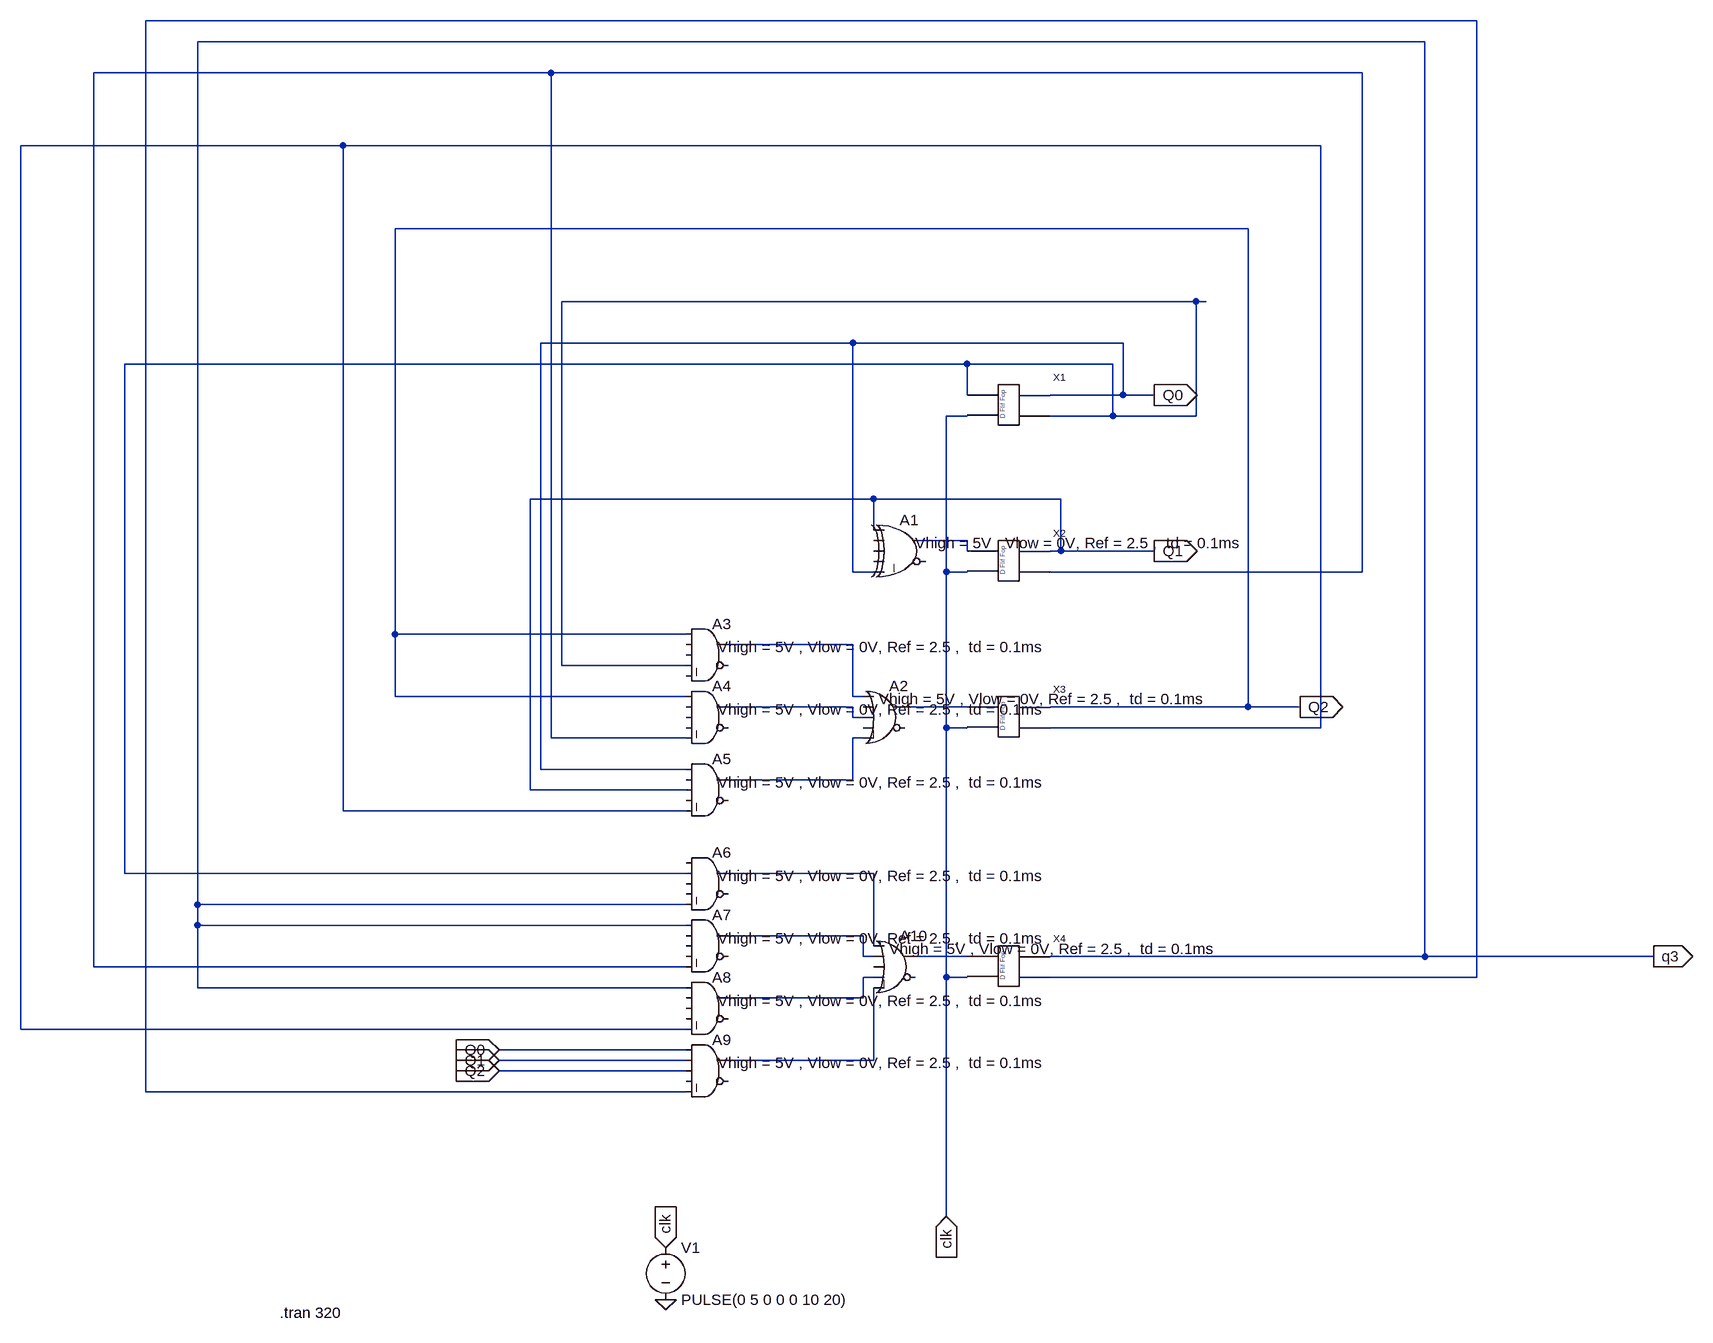
[diagram p0: schematic counter.asc]
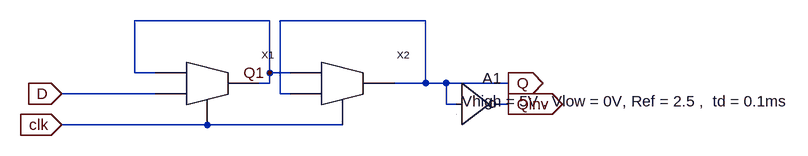
[diagram p1: sub-circuit d_flip_flop.asc]
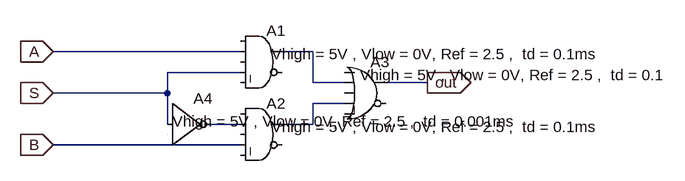
[diagram p2: sub-circuit 2_1_mux.asc]
counter.asc, the LTspice schematic file:
Version 4
SHEET 1 1448 1092
WIRE 1088 -912 -960 -912
WIRE 1008 -880 -880 -880
WIRE -336 -832 -1040 -832
WIRE 912 -832 -336 -832
WIRE -656 -720 -1152 -720
WIRE 848 -720 -656 -720
WIRE 736 -592 -576 -592
WIRE 656 -480 -320 -480
WIRE 672 -480 656 -480
WIRE 128 -416 -352 -416
WIRE 544 -416 128 -416
WIRE 304 -384 -992 -384
WIRE 528 -384 304 -384
WIRE 304 -336 304 -384
WIRE 544 -336 544 -416
WIRE 544 -336 432 -336
WIRE 592 -336 544 -336
WIRE 304 -304 272 -304
WIRE 528 -304 528 -384
WIRE 528 -304 432 -304
WIRE 656 -304 656 -480
WIRE 656 -304 528 -304
WIRE 160 -176 -368 -176
WIRE 448 -176 160 -176
WIRE 160 -128 160 -176
WIRE 304 -112 224 -112
WIRE 304 -96 304 -112
WIRE 448 -96 448 -176
WIRE 448 -96 432 -96
WIRE 592 -96 448 -96
WIRE 128 -64 128 -416
WIRE 160 -64 128 -64
WIRE 272 -64 272 -304
WIRE 304 -64 272 -64
WIRE 912 -64 912 -832
WIRE 912 -64 432 -64
WIRE -576 32 -576 -592
WIRE -128 32 -576 32
WIRE 128 48 -64 48
WIRE -320 80 -320 -480
WIRE -128 80 -320 80
WIRE -576 128 -576 32
WIRE -128 128 -576 128
WIRE 128 128 128 48
WIRE 144 128 128 128
WIRE 128 144 -64 144
WIRE 304 144 208 144
WIRE 736 144 736 -592
WIRE 736 144 432 144
WIRE 816 144 736 144
WIRE 128 160 128 144
WIRE 144 160 128 160
WIRE 272 176 272 -64
WIRE 304 176 272 176
WIRE 848 176 848 -720
WIRE 848 176 432 176
WIRE -336 192 -336 -832
WIRE -128 192 -336 192
WIRE 144 192 128 192
WIRE -352 240 -352 -416
WIRE -128 240 -352 240
WIRE 128 256 128 192
WIRE 128 256 -64 256
WIRE -368 272 -368 -176
WIRE -128 272 -368 272
WIRE -656 304 -656 -720
WIRE -128 304 -656 304
WIRE -992 400 -992 -384
WIRE -128 400 -992 400
WIRE 160 400 -64 400
WIRE -880 448 -880 -880
WIRE -128 448 -880 448
WIRE -880 480 -880 448
WIRE -128 480 -880 480
WIRE 144 496 -64 496
WIRE 160 512 160 400
WIRE 144 528 144 496
WIRE 160 528 144 528
WIRE 304 528 224 528
WIRE 1008 528 1008 -880
WIRE 1008 528 432 528
WIRE 1360 528 1008 528
WIRE -1040 544 -1040 -832
WIRE -128 544 -1040 544
WIRE 160 560 144 560
WIRE 272 560 272 176
WIRE 304 560 272 560
WIRE 1088 560 1088 -912
WIRE 1088 560 432 560
WIRE -880 576 -880 480
WIRE -128 576 -880 576
WIRE 144 592 144 560
WIRE 144 592 -64 592
WIRE -1152 640 -1152 -720
WIRE -128 640 -1152 640
WIRE -128 672 -416 672
WIRE -128 688 -416 688
WIRE 160 688 160 576
WIRE 160 688 -64 688
WIRE -128 704 -416 704
WIRE -960 736 -960 -912
WIRE -128 736 -960 736
WIRE 272 928 272 560
FLAG -160 976 clk
IOPIN -160 976 In
FLAG 272 928 clk
IOPIN 272 928 In
FLAG 592 -336 Q0
IOPIN 592 -336 Out
FLAG 592 -96 Q1
IOPIN 592 -96 Out
FLAG 816 144 Q2
IOPIN 816 144 Out
FLAG 1360 528 q3
IOPIN 1360 528 Out
FLAG -160 1056 0
FLAG -416 672 Q0
IOPIN -416 672 In
FLAG -416 688 Q1
IOPIN -416 688 In
FLAG -416 704 Q2
IOPIN -416 704 In
SYMBOL D_flip_flop 368 -320 R0
SYMATTR InstName X1
SYMBOL D_flip_flop 368 -80 R0
SYMATTR InstName X2
SYMBOL D_flip_flop 368 160 R0
SYMATTR InstName X3
SYMBOL D_flip_flop 368 544 R0
SYMATTR InstName X4
SYMBOL Digital\\xor 208 -160 R0
WINDOW 3 16 52 Left 2
SYMATTR InstName A1
SYMATTR Value Vhigh = 5V , Vlow = 0V, Ref = 2.5 ,  td = 0.1ms
SYMBOL Digital\\or 176 96 R0
WINDOW 3 -8 36 Left 2
SYMATTR InstName A2
SYMATTR Value Vhigh = 5V , Vlow = 0V, Ref = 2.5 ,  td = 0.1ms
SYMBOL Digital\\and -96 0 R0
WINDOW 3 16 52 Left 2
SYMATTR InstName A3
SYMATTR Value Vhigh = 5V , Vlow = 0V, Ref = 2.5 ,  td = 0.1ms
SYMBOL Digital\\and -96 96 R0
WINDOW 3 16 52 Left 2
SYMATTR InstName A4
SYMATTR Value Vhigh = 5V , Vlow = 0V, Ref = 2.5 ,  td = 0.1ms
SYMBOL Digital\\and -96 208 R0
WINDOW 3 16 52 Left 2
SYMATTR InstName A5
SYMATTR Value Vhigh = 5V , Vlow = 0V, Ref = 2.5 ,  td = 0.1ms
SYMBOL Digital\\and -96 352 R0
WINDOW 3 16 52 Left 2
SYMATTR InstName A6
SYMATTR Value Vhigh = 5V , Vlow = 0V, Ref = 2.5 ,  td = 0.1ms
SYMBOL Digital\\and -96 448 R0
WINDOW 3 16 52 Left 2
SYMATTR InstName A7
SYMATTR Value Vhigh = 5V , Vlow = 0V, Ref = 2.5 ,  td = 0.1ms
SYMBOL Digital\\and -96 544 R0
WINDOW 3 16 52 Left 2
SYMATTR InstName A8
SYMATTR Value Vhigh = 5V , Vlow = 0V, Ref = 2.5 ,  td = 0.1ms
SYMBOL Digital\\and -96 640 R0
WINDOW 3 16 52 Left 2
SYMATTR InstName A9
SYMATTR Value Vhigh = 5V , Vlow = 0V, Ref = 2.5 ,  td = 0.1ms
SYMBOL Digital\\or 192 480 R0
WINDOW 3 -8 36 Left 2
SYMATTR InstName A10
SYMATTR Value Vhigh = 5V , Vlow = 0V, Ref = 2.5 ,  td = 0.1ms
SYMBOL voltage -160 960 R0
WINDOW 123 0 0 Left 0
WINDOW 39 0 0 Left 0
SYMATTR InstName V1
SYMATTR Value PULSE(0 5 0 0 0 10 20)
TEXT -754 1076 Left 2 !.tran 320

d_flip_flop.asc, the sub-circuit schematic file:
Version 4
SHEET 1 1068 680
WIRE 224 0 16 0
WIRE 464 0 240 0
WIRE 16 80 16 0
WIRE 48 80 16 80
WIRE 224 80 224 0
WIRE 256 80 224 80
WIRE 224 96 224 80
WIRE 224 96 208 96
WIRE 464 96 464 0
WIRE 464 96 416 96
WIRE 496 96 464 96
WIRE 592 96 496 96
WIRE 48 112 -96 112
WIRE 240 112 240 0
WIRE 256 112 240 112
WIRE 496 128 496 96
WIRE 512 128 496 128
WIRE 592 128 576 128
WIRE 128 160 -96 160
WIRE 336 160 128 160
FLAG -96 112 D
IOPIN -96 112 In
FLAG -96 160 clk
IOPIN -96 160 In
FLAG 592 96 Q
IOPIN 592 96 Out
FLAG 592 128 Qinv
IOPIN 592 128 Out
FLAG 224 80 Q1
SYMBOL 2_1_mux 112 96 R0
SYMATTR InstName X1
SYMBOL 2_1_mux 320 96 R0
SYMATTR InstName X2
SYMBOL Digital\\inv 512 64 R0
WINDOW 3 8 60 Left 2
SYMATTR Value Vhigh = 5V , Vlow = 0V, Ref = 2.5 ,  td = 0.1ms
SYMATTR InstName A1

2_1_mux.asc, the sub-circuit schematic file:
Version 4
SHEET 1 880 840
WIRE 160 80 -128 80
WIRE 272 80 224 80
WIRE 160 112 48 112
WIRE 272 128 272 80
WIRE 320 128 272 128
WIRE 448 128 384 128
WIRE 48 144 48 112
WIRE 48 144 -128 144
WIRE 320 160 272 160
WIRE 48 192 48 144
WIRE 160 192 112 192
WIRE 272 192 272 160
WIRE 272 192 224 192
WIRE 160 224 -128 224
FLAG 448 128 out
IOPIN 448 128 Out
FLAG -128 80 A
IOPIN -128 80 In
FLAG -128 144 S
IOPIN -128 144 In
FLAG -128 224 B
IOPIN -128 224 In
SYMBOL Digital\\and 192 32 R0
WINDOW 3 16 52 Left 2
SYMATTR InstName A1
SYMATTR Value Vhigh = 5V , Vlow = 0V, Ref = 2.5 ,  td = 0.1ms
SYMBOL Digital\\and 192 144 R0
WINDOW 3 16 52 Left 2
SYMATTR InstName A2
SYMATTR Value Vhigh = 5V , Vlow = 0V, Ref = 2.5 ,  td = 0.1ms
SYMBOL Digital\\or 352 80 R0
WINDOW 3 -8 36 Left 2
SYMATTR InstName A3
SYMATTR Value Vhigh = 5V , Vlow = 0V, Ref = 2.5 ,  td = 0.1
SYMBOL Digital\\inv 48 128 R0
WINDOW 3 8 60 Left 2
SYMATTR InstName A4
SYMATTR Value Vhigh = 5V , Vlow = 0V, Ref = 2.5 ,  td = 0.001ms

The netlist it stands for:
* counter.asc
XX1 N004 clk Q0 N004 d_flip_flop
XX2 N005 clk Q1 N002 d_flip_flop
XX3 N008 clk Q2 N003 d_flip_flop
XX4 N012 clk q3 N001 d_flip_flop
A1 Q1 0 0 0 Q0 0 N005 0 XOR Vhigh = 5V , Vlow = 0V, Ref = 2.5 ,  td = 0.1ms
A2 N006 0 N007 0 N009 0 N008 0 OR Vhigh = 5V , Vlow = 0V, Ref = 2.5 ,  td = 0.1ms
A3 Q2 0 0 N004 0 0 N006 0 AND Vhigh = 5V , Vlow = 0V, Ref = 2.5 ,  td = 0.1ms
A4 Q2 0 0 0 N002 0 N007 0 AND Vhigh = 5V , Vlow = 0V, Ref = 2.5 ,  td = 0.1ms
A5 Q0 0 Q1 0 N003 0 N009 0 AND Vhigh = 5V , Vlow = 0V, Ref = 2.5 ,  td = 0.1ms
A6 0 N004 0 0 q3 0 N010 0 AND Vhigh = 5V , Vlow = 0V, Ref = 2.5 ,  td = 0.1ms
A7 q3 0 0 0 N002 0 N011 0 AND Vhigh = 5V , Vlow = 0V, Ref = 2.5 ,  td = 0.1ms
A8 q3 0 0 0 N003 0 N013 0 AND Vhigh = 5V , Vlow = 0V, Ref = 2.5 ,  td = 0.1ms
A9 Q0 Q1 Q2 0 N001 0 N014 0 AND Vhigh = 5V , Vlow = 0V, Ref = 2.5 ,  td = 0.1ms
A10 N010 N011 0 N013 N014 0 N012 0 OR Vhigh = 5V , Vlow = 0V, Ref = 2.5 ,  td = 0.1ms
V1 clk 0 PULSE(0 5 0 0 0 10 20)

* block symbol definitions
.subckt d_flip_flop D clk Q Qinv
XX1 Q1 D clk Q1 2_1_mux
XX2 Q1 Q clk Q 2_1_mux
A1 Q 0 0 0 0 Qinv 0 0 BUF Vhigh = 5V , Vlow = 0V, Ref = 2.5 ,  td = 0.1ms
.ends d_flip_flop

.subckt 2_1_mux A B S out
A1 0 A 0 S 0 0 N001 0 AND Vhigh = 5V , Vlow = 0V, Ref = 2.5 ,  td = 0.1ms
A2 0 N003 0 B 0 0 N002 0 AND Vhigh = 5V , Vlow = 0V, Ref = 2.5 ,  td = 0.1ms
A3 0 N001 0 N002 0 0 out 0 OR Vhigh = 5V , Vlow = 0V, Ref = 2.5 ,  td = 0.1
A4 S 0 0 0 0 N003 0 0 BUF Vhigh = 5V , Vlow = 0V, Ref = 2.5 ,  td = 0.001ms
.ends 2_1_mux

.tran 320
.backanno
.end